# EAGLE design pi-crust-protohat (EAGLE 7.6.0)
PiCrust B+ HAT
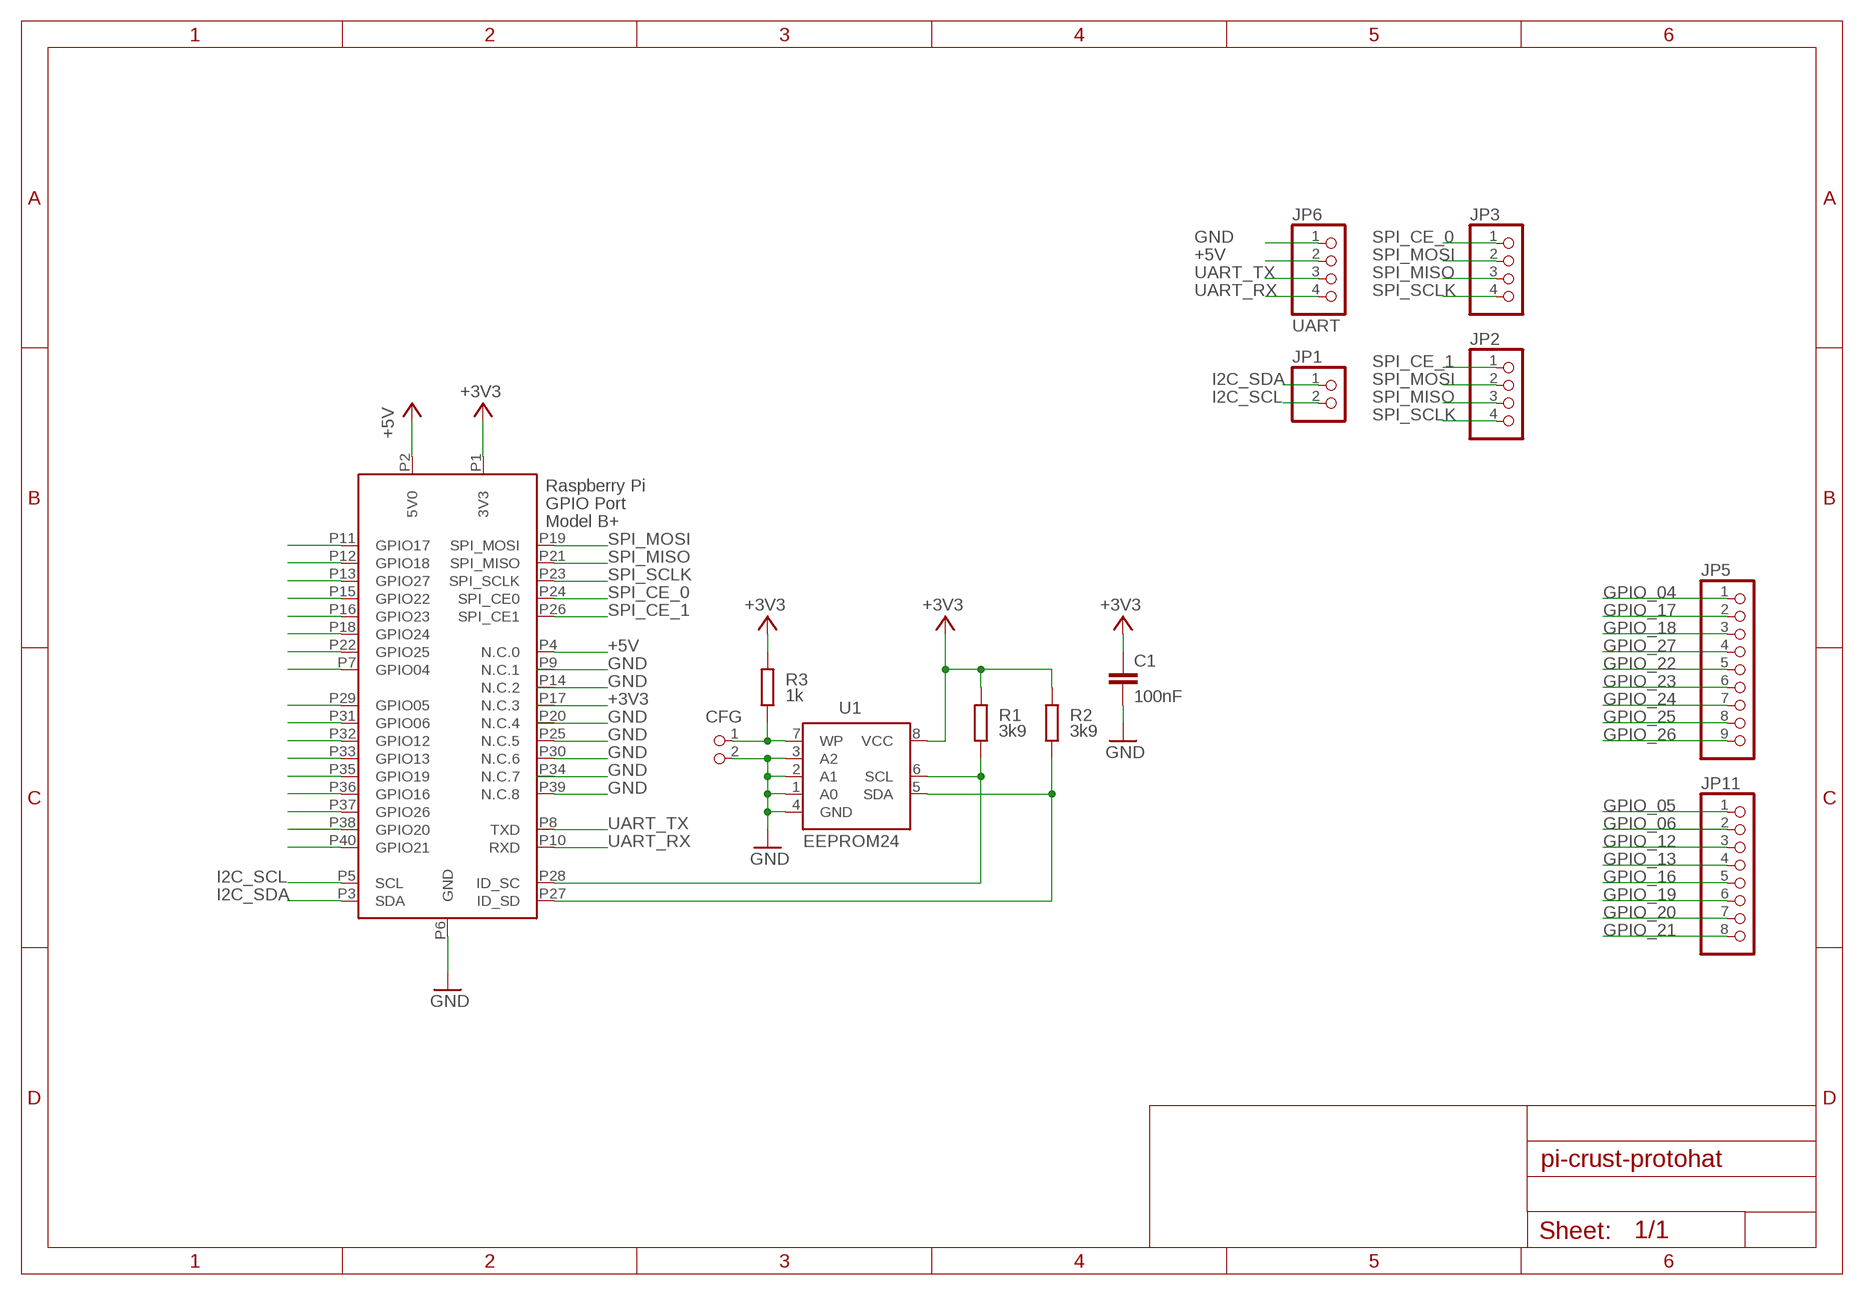
[diagram p0: schematic, sheet 1]

## Parts
C1  100nF  C-EUC0805K  [C0805K]
CFG  PIN2_100  [PIN_W_2]
JP1  PINHD-1X2  [1X02]
JP2  PINHD-1X4  [1X04]
JP3  PINHD-1X4  [1X04]
JP5  PINHD-1X9  [1X09]
JP6  UART  PINHD-1X4  [1X04]
JP11  PINHD-1X8  [1X08]
R1  3k9  R-EU_M0805  [M0805]
R2  3k9  R-EU_M0805  [M0805]
R3  1k  R-EU_M0805  [M0805]
U1  EEPROM24  [SOIC8]
U$1  RASPI_BOARD_B+_SMD  [RASPI_BOARD_B+_SMD_CONNECTOR]

## Nets
+3V3: C1.1 R1.2 R2.2 R3.2 U1.8(VCC) U$1.P1(3V3)
+5V: JP6.2 U$1.P2(5V0) U$1.P4(N.C.0)
GND: C1.2 CFG.2 JP6.1 U1.1(A0) U1.2(A1) U1.3(A2) U1.4(GND) U$1.P6(GND) U$1.P25(N.C.5) U$1.P30(N.C.6) U$1.P39(N.C.8)
GPIO_04: JP5.1 U$1.P7(GPIO04)
GPIO_05: JP11.1 U$1.P29(GPIO05)
GPIO_06: JP11.2 U$1.P31(GPIO06)
GPIO_12: JP11.3 U$1.P32(GPIO12)
GPIO_13: JP11.4 U$1.P33(GPIO13)
GPIO_16: JP11.5 U$1.P36(GPIO16)
GPIO_17: JP5.2 U$1.P11(GPIO17)
GPIO_18: JP5.3 U$1.P12(GPIO18)
GPIO_19: JP11.6 U$1.P35(GPIO19)
GPIO_20: JP11.7 U$1.P38(GPIO20)
GPIO_21: JP11.8 U$1.P40(GPIO21)
GPIO_22: JP5.5 U$1.P15(GPIO22)
GPIO_23: JP5.6 U$1.P16(GPIO23)
GPIO_24: JP5.7 U$1.P18(GPIO24)
GPIO_25: JP5.8 U$1.P22(GPIO25)
GPIO_26: JP5.9 U$1.P37(GPIO26)
GPIO_27: JP5.4 U$1.P13(GPIO27)
I2C_SCL: JP1.2 U$1.P5(SCL)
I2C_SDA: JP1.1 U$1.P3(SDA)
N$3: CFG.1 R3.1 U1.7(WP)
N$4: R1.1 U1.6(SCL) U$1.P28(ID_SC)
N$5: R2.1 U1.5(SDA) U$1.P27(ID_SD)
SPI_CE_0: JP3.1 U$1.P24(SPI_CE0)
SPI_CE_1: JP2.1 U$1.P26(SPI_CE1)
SPI_MISO: JP2.3 JP3.3 U$1.P21(SPI_MISO)
SPI_MOSI: JP2.2 JP3.2 U$1.P19(SPI_MOSI)
SPI_SCLK: JP2.4 JP3.4 U$1.P23(SPI_SCLK)
UART_RX: JP6.4 U$1.P10(RXD)
UART_TX: JP6.3 U$1.P8(TXD)
Unconnected: U$1.P9(N.C.1) U$1.P14(N.C.2) U$1.P17(N.C.3) U$1.P20(N.C.4) U$1.P34(N.C.7)

## Library data of the parts
C1 = resistor:C-EU: CAPACITOR, European symbol; DIELECTRIC: X7R
CFG = FLYFISH:PIN2
JP1 = pinhead:PINHD-1X2: PIN HEADER
JP2 JP3 JP6 = pinhead:PINHD-1X4: PIN HEADER
JP5 = pinhead:PINHD-1X9: PIN HEADER
JP11 = pinhead:PINHD-1X8: PIN HEADER
R1-R3 = resistor:R-EU_: RESISTOR, European symbol; TOLERANCE: 5%
U1 = FLYFISH:EEPROM24
U$1 = raspberrypi_bastelstube_v13:RASPI_BOARD_B+_SMD

## Board
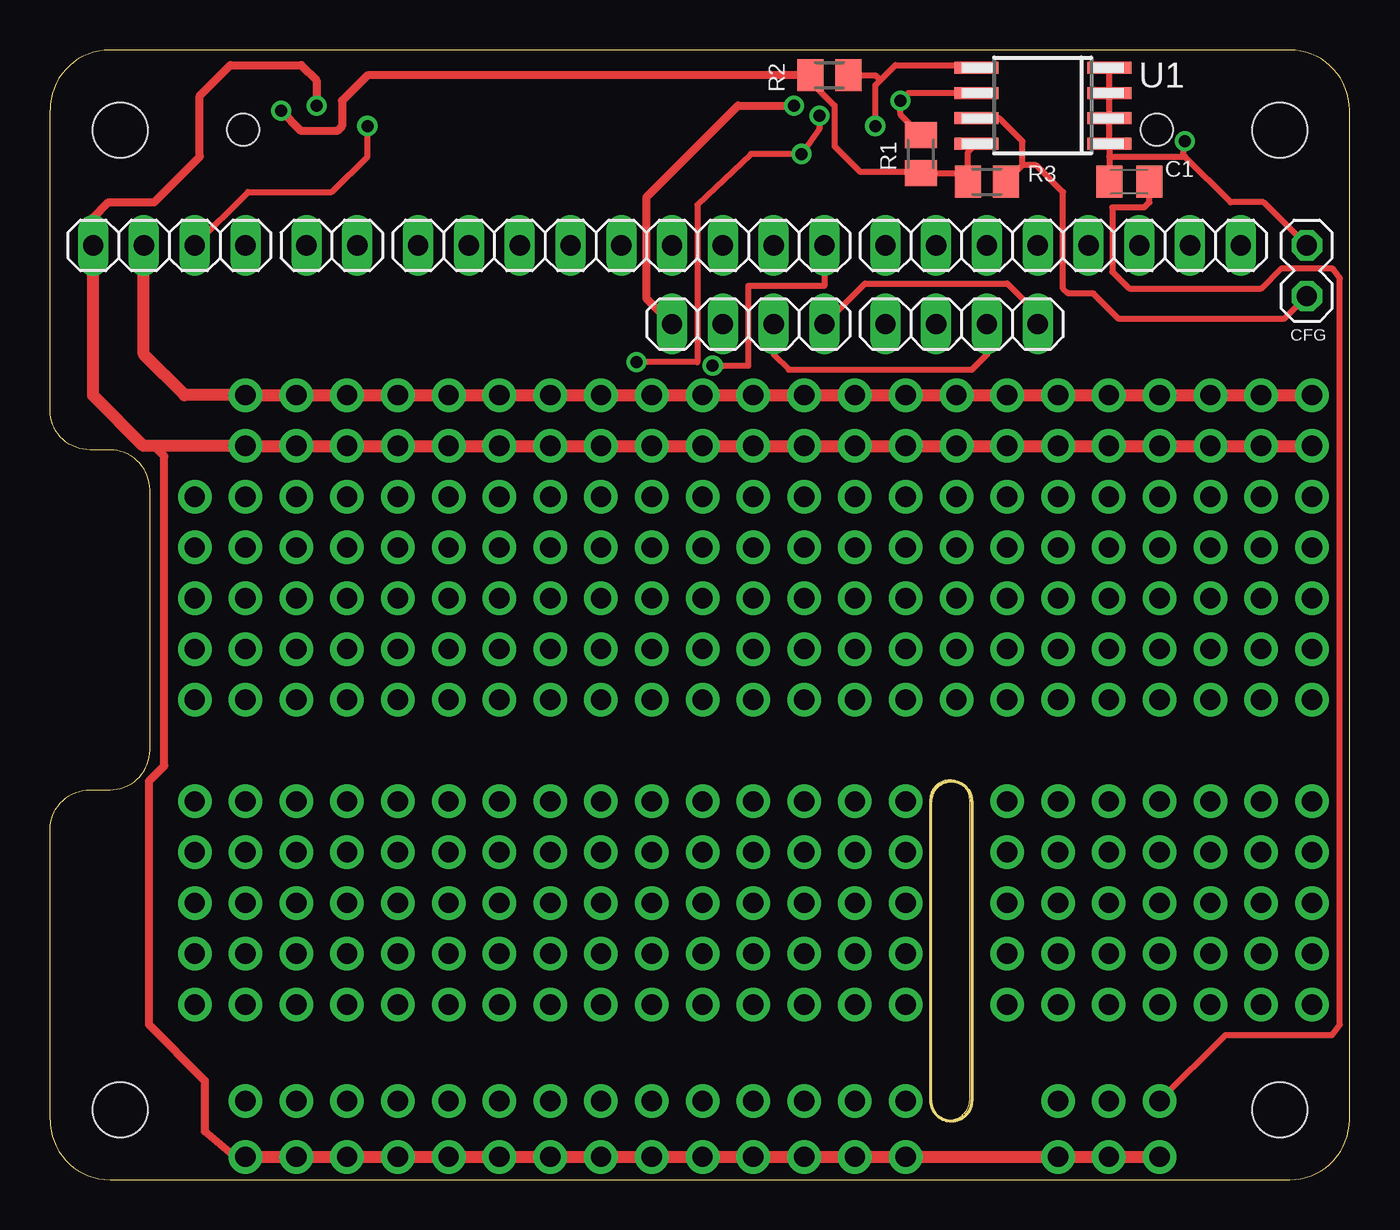
[diagram p1: board, top side]
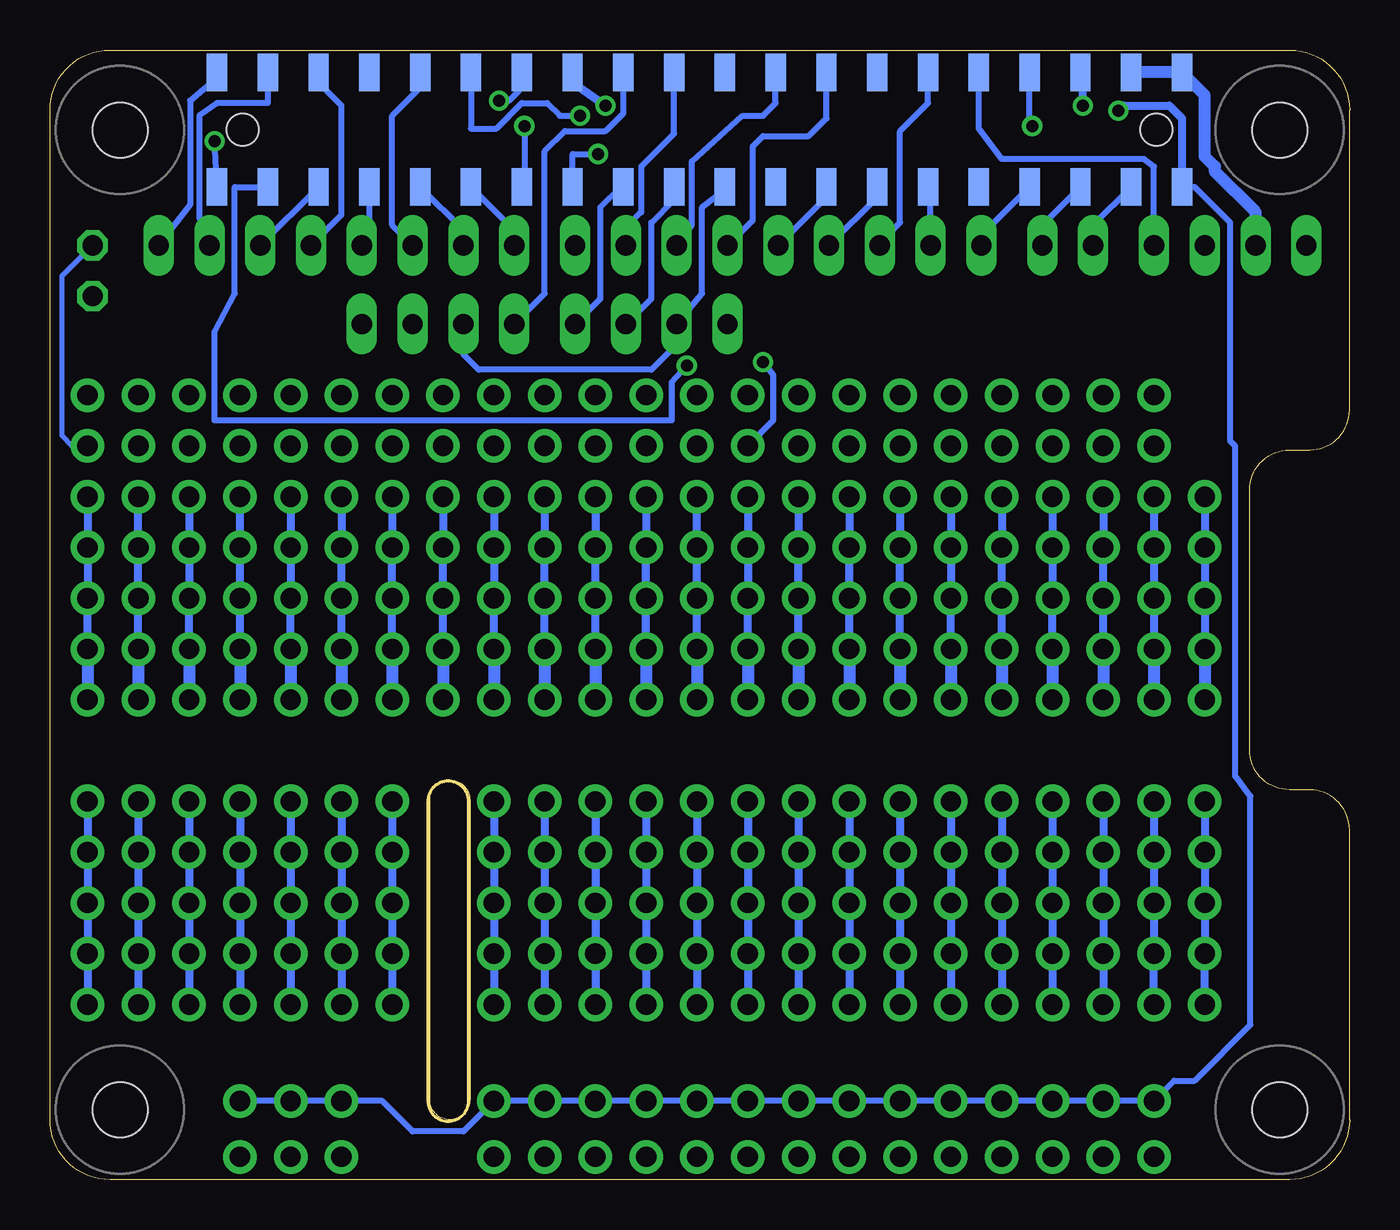
[diagram p2: board, bottom side, seen from below]

Size 65 x 56.51 mm. Coordinates in mm from the lower left corner, seen from the top.
Outline: 44.07,3.94 44.07,18.92 arc-180 46.1,18.92 46.1,3.94 arc-180 44.07,3.94
Copper layers (1*16): Top 0.035mm / dielectric 1.5mm / Bottom 0.035mm
Design rules "default *": minimum track width 10mil, minimum drill 24mil, track to track 8mil, track to pad 8mil, pad to pad 8mil, via to via 8mil, smd to smd 8mil, copper to edge 40mil, drill to drill 8mil, minimum pad ring 10mil, minimum via ring 8mil, stop-mask expansion 4mil, vias tented up to drill 24mil, thermal gap 10mil

### Footprints (pad centres in the part's own frame; a part is rotated, then mirrored left to right if it is on the bottom)
C0805K = smd 1.3 x 1.6: 1 -1,0; 2 1,0
PIN_W_2 = drill 1.016 octagon: 1 0,0; 2 0,-2.54
1X02 = drill 1.016 long: 1 -1.27,0; 2 1.27,0
1X04 = drill 1.016 long: 1 -3.81,0; 2 -1.27,0; 3 1.27,0; 4 3.81,0
1X09 = drill 1.016 long: 1 -10.16,0; 2 -7.62,0; 3 -5.08,0; 4 -2.54,0; 5 0,0; 6 2.54,0; 7 5.08,0; 8 7.62,0; 9 10.16,0
1X08 = drill 1.016 long: 1 -8.89,0; 2 -6.35,0; 3 -3.81,0; 4 -1.27,0; 5 1.27,0; 6 3.81,0; 7 6.35,0; 8 8.89,0
M0805 = smd 1.3 x 1.6: 1 -0.95,0; 2 0.95,0
SOIC8 = smd 0.6 x 2.2: 1 -1.905,-3.33; 2 -0.635,-3.33; 3 0.635,-3.33; 4 1.905,-3.33; 5 1.905,3.33; 6 0.635,3.33; 7 -0.635,3.33; 8 -1.905,3.33
RASPI_BOARD_B+_SMD_CONNECTOR = smd 1.02 x 1.87 bottom: P1 4.953,-2.794; P2 4.953,2.936; P3 7.493,-2.794; P4 7.493,2.936; P5 10.033,-2.794; P6 10.033,2.936; P7 12.573,-2.794; P8 12.573,2.936; P9 15.113,-2.794; P10 15.113,2.936; P11 17.653,-2.794; P12 17.653,2.936; P13 20.193,-2.794; P14 20.193,2.936; P15 22.733,-2.794; P16 22.733,2.936; P17 25.273,-2.794; P18 25.273,2.936; P19 27.813,-2.794; P20 27.813,2.936; P21 30.353,-2.794; P22 30.353,2.936; P23 32.893,-2.794; P24 32.893,2.936; P25 35.433,-2.794; P26 35.433,2.936; P27 37.973,-2.794; P28 37.973,2.936; P29 40.513,-2.794; P30 40.513,2.936; P31 43.053,-2.794; P32 43.053,2.936; P33 45.593,-2.794; P34 45.593,2.936; P35 48.133,-2.794; P36 48.133,2.936; P37 50.673,-2.794; P38 50.673,2.936; P39 53.213,-2.794; P40 53.213,2.936 | hole 2.75: 0.071,-48.951; 0.071,0.049; 58.071,-48.951; 58.071,0.049 | hole 1.6: 6.223,0.071; 51.943,0.071

### Placement (x,y rotation side)
C1  53.98,49.91 180 top
CFG  62.87,44.2 180 top
JP1  14.1,46.74 0 top
JP2  34.93,42.8 0 top
JP3  45.59,42.8 0 top
JP5  28.57,46.74 0 top
JP6  5.97,46.74 0 top
JP11  50.67,46.74 0 top
R1  43.56,51.31 270 top
R2  38.99,55.25 180 top
R3  46.86,49.91 180 top
U1  49.66,53.72 90 top
U$1  3.43,52.45 0 top

### Tracks (layer width: path | path; a pad name or v marks a point on that pad's centre or on a via)
+3V3  (via drill 0.6, 1.02 pad 1.68)
  Top 0.305: v55.5,3.94 58.8,7.24 64.13,7.24 64.52,7.75 64.52,45.09 64.13,45.59 61.6,45.59 60.58,44.58 53.98,44.58 53.14,45.42 53.14,48.64 54.74,48.64 54.99,48.9 54.99,49.9 C1.1 | R2.2 38.04,54.93 39.24,53.72 39.24,51.69 40.51,50.42 43.5,50.42 R1.2 45.47,50.36 R3.2 45.91,51.4 U1.8
  Top 0.406: R2.2 15.88,55.25 14.61,53.98 14.61,52.71 14.35,52.45 12.57,52.45 v11.56,53.47
  Bottom 0.254: 55.5,4.06 v55.5,3.94
  Bottom 0.305: v55.5,3.94 v52.96,3.94 v50.42,3.94 48.39,3.94 46.86,2.41 44.32,2.41 v42.8,3.94 v40.26,3.94 v37.72,3.94 v35.18,3.94 v32.64,3.94 v30.1,3.94 v27.56,3.94 v25.02,3.94 v22.48,3.94 v19.94,3.94 v17.4,3.94 v14.86,3.94 v12.32,3.94 v9.78,3.94 8.76,4.95 7.75,4.95 4.95,7.75 4.95,19.18 5.71,20.19 5.71,36.7 5.97,36.96 5.97,47.88 7.75,49.66 U$1.P1
  Bottom 0.406: v11.56,53.47 11.3,53.72 9.02,53.72 8.38,53.09 U$1.P1
+5V  (via drill 1.02 pad 1.68)
  Top 0.61: v63.12,39.24 v60.58,39.24 v58.04,39.24 v55.5,39.24 v52.96,39.24 v50.42,39.24 v47.88,39.24 v45.34,39.24 v42.8,39.24 v40.26,39.24 v37.72,39.24 v35.18,39.24 v32.64,39.24 v30.1,39.24 v27.56,39.24 v25.02,39.24 v22.48,39.24 v19.94,39.24 v17.4,39.24 v14.86,39.24 v12.32,39.24 v9.78,39.24 6.73,39.24 4.7,41.28 JP6.2
  Bottom 0.61: JP6.2 4.7,48.39 6.73,50.42 6.73,50.67 7.24,51.18 7.24,54.24 U$1.P2 U$1.P4
GND  (via drill 0.6, 0.76 pad 1.68, 1.02 pad 1.68)
  Top 0.305: U1.1 U1.2 U1.3 U1.4 | U1.1 C1.2 | CFG.2 60.71,48.9 59.05,48.9 56.77,51.18 56.64,51.18 | U1.1 52.99,51.18 56.64,51.18 | v56.77,51.94 56.64,51.18 | v29.34,40.89 32.39,40.89 32.39,48.77 35.05,51.31 v37.59,51.31 38.48,52.58 v38.48,53.21
  Top 0.406: 9.27,1.14 7.75,2.41 7.75,4.95 4.95,7.75 4.95,19.94 5.71,20.7 5.71,36.2 5.21,36.7 | JP6.1 2.16,48.13 2.92,48.9 5.21,48.9 7.49,51.18 7.49,54.23 9.02,55.75 12.57,55.75 13.34,54.99 v13.34,53.72
  Top 0.61: 9.27,1.14 v9.78,1.14 v12.32,1.14 v14.86,1.14 v17.4,1.14 v19.94,1.14 v22.48,1.14 v25.02,1.14 v27.56,1.14 v30.1,1.14 v32.64,1.14 v35.18,1.14 v37.72,1.14 | v55.5,1.14 v52.96,1.14 v50.42,1.14 v37.72,1.14 | v63.12,36.7 v60.58,36.7 v58.04,36.7 v55.5,36.7 v52.96,36.7 v50.42,36.7 v47.88,36.7 v45.34,36.7 v42.8,36.7 v40.26,36.7 v37.72,36.7 v35.18,36.7 v32.64,36.7 v30.1,36.7 v27.56,36.7 v25.02,36.7 v22.48,36.7 v19.94,36.7 v17.4,36.7 v14.86,36.7 v12.32,36.7 v9.78,36.7 5.21,36.7 4.7,36.7 2.16,39.24 JP6.1 | v37.72,1.14 v40.26,1.14 v42.8,1.14
  Bottom 0.254: v63.12,36.7 63.88,36.7 64.39,37.21 64.39,45.21 CFG.2
  Bottom 0.305: U$1.P39 v56.77,51.94 | U$1.P25 38.86,51.31 v37.59,51.31 | v29.34,40.89 28.83,40.26 28.83,37.97 v30.1,36.7 | U$1.P30 43.94,52.58 42.67,52.58 41.4,53.85 40.13,53.85 39.5,53.21 v38.48,53.21
  Bottom 0.406: v13.34,53.72 13.34,55.26 U$1.P6
GPIO_04
  Bottom 0.305: JP5.1 18.41,47.24 U$1.P7
GPIO_05
  Bottom 0.305: JP11.1 41.78,47.5 U$1.P29
GPIO_06
  Bottom 0.305: JP11.2 44.32,47.5 U$1.P31
GPIO_12
  Bottom 0.305: JP11.3 47.88,47.75 47.88,53.21 46.48,54.61 U$1.P32
GPIO_13
  Bottom 0.305: JP11.4 49.02,47.12 U$1.P33
GPIO_16
  Bottom 0.305: JP11.5 50.42,48.26 50.42,53.72 51.56,54.86 U$1.P36
GPIO_17
  Bottom 0.305: JP5.2 20.95,49.53 U$1.P11
GPIO_18
  Bottom 0.305: JP5.3 23.49,46.86 22.48,47.88 22.48,52.45 21.08,53.85 U$1.P12
GPIO_19
  Bottom 0.305: JP11.6 U$1.P35
GPIO_20
  Bottom 0.305: U$1.P38 54.1,53.85 56.64,53.85 57.53,53.21 57.53,48.13 JP11.7
GPIO_21
  Bottom 0.305: U$1.P40 56.64,55.12 57.99,53.98 57.99,48.77 JP11.8
GPIO_22
  Bottom 0.305: JP5.5 26.16,49.15 U$1.P15
GPIO_23
  Bottom 0.305: JP5.6 29.84,48.01 29.84,51.69 29.34,52.2 27.05,52.2 26.16,53.09 U$1.P16
GPIO_24
  Bottom 0.305: JP5.7 32.89,47.75 32.89,50.93 30.35,53.21 29.34,53.21 28.7,53.85 U$1.P18
GPIO_25
  Bottom 0.305: U$1.P22 33.78,52.32 35.43,50.67 35.43,48.39 36.2,47.62 JP5.8
GPIO_26  (via drill 0.6)
  Top 0.305: JP5.9 38.73,44.7 34.93,44.7 34.93,40.72 v33.15,40.72
  Bottom 0.305: v33.15,40.72 33.91,39.88 33.91,37.97 56.77,37.97 56.77,42.42 55.75,44.32 55.75,49.66 U$1.P37
GPIO_27
  Bottom 0.305: JP5.4 23.62,49.15 U$1.P13
I2C_SCL
  Bottom 0.305: JP1.2 15.37,47.75 U$1.P5
I2C_SDA
  Bottom 0.305: JP1.1 12.83,47.75 U$1.P3
N$1  (via drill 1.02 pad 1.68)
  Bottom 0.406: v7.24,34.16 v7.24,31.62 v7.24,29.08 v7.24,26.54
  Bottom 0.61: v7.24,26.54 v7.24,24
N$2  (via drill 1.02 pad 1.68)
  Bottom 0.406: v7.24,18.92 v7.24,16.38 v7.24,13.84 v7.24,11.3 v7.24,8.76
N$3
  Top 0.305: R3.1 48.64,50.74 | 48.64,50.74 48.64,51.94 47.5,53.09 U1.7 | CFG.1 61.72,43.05 53.47,43.05 52.2,44.32 50.93,44.32 50.67,44.58 50.67,49.4 49.34,50.74 48.64,50.74
N$4  (via drill 0.6)
  Top 0.305: U1.6 42.93,54.36 v42.55,53.98 42.55,53.27 R1.1
  Bottom 0.305: v42.55,53.98 42.04,53.98 41.53,54.48 41.53,55.77 U$1.P28
N$5  (via drill 0.6)
  Top 0.305: v41.28,52.71 41.28,54.74 41.53,54.99 | 41.53,54.99 42.29,55.75 46.2,55.75 U1.5 | R2.1 41.28,55.25 41.53,54.99
  Bottom 0.305: v41.28,52.71 41.28,50.29 U$1.P27
N$6  (via drill 1.02 pad 1.68)
  Bottom 0.406: v45.34,34.16 v45.34,31.62 v45.34,29.08 v45.34,26.54
  Bottom 0.61: v45.34,26.54 v45.34,24
N$7  (via drill 1.02 pad 1.68)
  Bottom 0.406: v47.88,34.16 v47.88,31.62 v47.88,29.08 v47.88,26.54
  Bottom 0.61: v47.88,26.54 v47.88,24
N$8  (via drill 1.02 pad 1.68)
  Bottom 0.406: v60.58,34.16 v60.58,31.62 v60.58,29.08 v60.58,26.54
  Bottom 0.61: v60.58,26.54 v60.58,24
N$9  (via drill 1.02 pad 1.68)
  Bottom 0.406: v63.12,34.16 v63.12,31.62 v63.12,29.08 v63.12,26.54
  Bottom 0.61: v63.12,26.54 v63.12,24
N$10  (via drill 1.02 pad 1.68)
  Bottom 0.406: v58.04,18.92 v58.04,16.38 v58.04,13.84 v58.04,11.3 v58.04,8.76
N$11  (via drill 1.02 pad 1.68)
  Bottom 0.406: v60.58,18.92 v60.58,16.38 v60.58,13.84 v60.58,11.3 v60.58,8.76
N$12  (via drill 1.02 pad 1.68)
  Bottom 0.406: v63.12,18.92 v63.12,16.38 v63.12,13.84 v63.12,11.3 v63.12,8.76
N$51  (via drill 1.02 pad 1.68)
  Bottom 0.406: v9.78,34.16 v9.78,31.62 v9.78,29.08 v9.78,26.54
  Bottom 0.61: v9.78,26.54 v9.78,24
N$144  (via drill 1.02 pad 1.68)
  Bottom 0.406: v12.32,34.16 v12.32,31.62 v12.32,29.08 v12.32,26.54
  Bottom 0.61: v12.32,26.54 v12.32,24
N$145  (via drill 1.02 pad 1.68)
  Bottom 0.406: v14.86,34.16 v14.86,31.62 v14.86,29.08 v14.86,26.54
  Bottom 0.61: v14.86,26.54 v14.86,24
N$146  (via drill 1.02 pad 1.68)
  Bottom 0.406: v17.4,34.16 v17.4,31.62 v17.4,29.08 v17.4,26.54
  Bottom 0.61: v17.4,26.54 v17.4,24
N$147  (via drill 1.02 pad 1.68)
  Bottom 0.406: v19.94,34.16 v19.94,31.62 v19.94,29.08 v19.94,26.54
  Bottom 0.61: v19.94,26.54 v19.94,24
N$148  (via drill 1.02 pad 1.68)
  Bottom 0.406: v22.48,34.16 v22.48,31.62 v22.48,29.08 v22.48,26.54
  Bottom 0.61: v22.48,26.54 v22.48,24
N$149  (via drill 1.02 pad 1.68)
  Bottom 0.406: v25.02,34.16 v25.02,31.62 v25.02,29.08 v25.02,26.54
  Bottom 0.61: v25.02,26.54 v25.02,24
N$150  (via drill 1.02 pad 1.68)
  Bottom 0.406: v27.56,34.16 v27.56,31.62 v27.56,29.08 v27.56,26.54
  Bottom 0.61: v27.56,26.54 v27.56,24
N$151  (via drill 1.02 pad 1.68)
  Bottom 0.406: v30.1,34.16 v30.1,31.62 v30.1,29.08 v30.1,26.54
  Bottom 0.61: v30.1,26.54 v30.1,24
N$152  (via drill 1.02 pad 1.68)
  Bottom 0.406: v32.64,34.16 v32.64,31.62 v32.64,29.08 v32.64,26.54
  Bottom 0.61: v32.64,26.54 v32.64,24
N$153  (via drill 1.02 pad 1.68)
  Bottom 0.406: v35.18,34.16 v35.18,31.62 v35.18,29.08 v35.18,26.54
  Bottom 0.61: v35.18,26.54 v35.18,24
N$154  (via drill 0.76 pad 1.68, 1.02 pad 1.68)
  Bottom 0.406: v37.72,34.16 v37.72,31.62 v37.72,29.08 v37.72,26.54
  Bottom 0.61: v37.72,26.54 v37.72,24
N$155  (via drill 1.02 pad 1.68)
  Bottom 0.406: v40.26,34.16 v40.26,31.62 v40.26,29.08 v40.26,26.54
  Bottom 0.61: v40.26,26.54 v40.26,24
N$156  (via drill 1.02 pad 1.68)
  Bottom 0.406: v42.8,34.16 v42.8,31.62 v42.8,29.08 v42.8,26.54
  Bottom 0.61: v42.8,26.54 v42.8,24
N$158  (via drill 1.02 pad 1.68)
  Bottom 0.406: v9.78,18.92 v9.78,16.38 v9.78,13.84 v9.78,11.3 v9.78,8.76
N$159  (via drill 1.02 pad 1.68)
  Bottom 0.406: v12.32,18.92 v12.32,16.38 v12.32,13.84 v12.32,11.3 v12.32,8.76
N$160  (via drill 1.02 pad 1.68)
  Bottom 0.406: v14.86,18.92 v14.86,16.38 v14.86,13.84 v14.86,11.3 v14.86,8.76
N$161  (via drill 1.02 pad 1.68)
  Bottom 0.406: v17.4,18.92 v17.4,16.38 v17.4,13.84 v17.4,11.3 v17.4,8.76
N$162  (via drill 1.02 pad 1.68)
  Bottom 0.406: v19.94,18.92 v19.94,16.38 v19.94,13.84 v19.94,11.3 v19.94,8.76
N$163  (via drill 1.02 pad 1.68)
  Bottom 0.406: v22.48,18.92 v22.48,16.38 v22.48,13.84 v22.48,11.3 v22.48,8.76
N$164  (via drill 1.02 pad 1.68)
  Bottom 0.406: v25.02,18.92 v25.02,16.38 v25.02,13.84 v25.02,11.3 v25.02,8.76
N$165  (via drill 1.02 pad 1.68)
  Bottom 0.406: v27.56,18.92 v27.56,16.38 v27.56,13.84 v27.56,11.3 v27.56,8.76
N$166  (via drill 1.02 pad 1.68)
  Bottom 0.406: v30.1,18.92 v30.1,16.38 v30.1,13.84 v30.1,11.3 v30.1,8.76
N$167  (via drill 1.02 pad 1.68)
  Bottom 0.406: v32.64,18.92 v32.64,16.38 v32.64,13.84 v32.64,11.3 v32.64,8.76
N$168  (via drill 1.02 pad 1.68)
  Bottom 0.406: v35.18,18.92 v35.18,16.38 v35.18,13.84 v35.18,11.3 v35.18,8.76
N$169  (via drill 1.02 pad 1.68)
  Bottom 0.406: v37.72,18.92 v37.72,16.38 v37.72,13.84 v37.72,11.3 v37.72,8.76
N$170  (via drill 1.02 pad 1.68)
  Bottom 0.406: v40.26,18.92 v40.26,16.38 v40.26,13.84 v40.26,11.3 v40.26,8.76
N$171  (via drill 1.02 pad 1.68)
  Bottom 0.406: v42.8,18.92 v42.8,16.38 v42.8,13.84 v42.8,11.3 v42.8,8.76
N$232  (via drill 1.02 pad 1.68)
  Bottom 0.406: v50.42,34.16 v50.42,31.62 v50.42,29.08 v50.42,26.54
  Bottom 0.61: v50.42,26.54 v50.42,24
N$233  (via drill 1.02 pad 1.68)
  Bottom 0.406: v52.96,34.16 v52.96,31.62 v52.96,29.08 v52.96,26.54
  Bottom 0.61: v52.96,26.54 v52.96,24
N$234  (via drill 1.02 pad 1.68)
  Bottom 0.406: v55.5,34.16 v55.5,31.62 v55.5,29.08 v55.5,26.54
  Bottom 0.61: v55.5,26.54 v55.5,24
N$235  (via drill 1.02 pad 1.68)
  Bottom 0.406: v58.04,34.16 v58.04,31.62 v58.04,29.08 v58.04,26.54
  Bottom 0.61: v58.04,26.54 v58.04,24
N$238  (via drill 1.02 pad 1.68)
  Bottom 0.406: v47.88,18.92 v47.88,16.38 v47.88,13.84 v47.88,11.3 v47.88,8.76
N$239  (via drill 1.02 pad 1.68)
  Bottom 0.406: v50.42,18.92 v50.42,16.38 v50.42,13.84 v50.42,11.3 v50.42,8.76
N$240  (via drill 1.02 pad 1.68)
  Bottom 0.406: v52.96,18.92 v52.96,16.38 v52.96,13.84 v52.96,11.3 v52.96,8.76
N$241  (via drill 1.02 pad 1.68)
  Bottom 0.406: v55.5,18.92 v55.5,16.38 v55.5,13.84 v55.5,11.3 v55.5,8.76
SPI_CE_0
  Bottom 0.305: JP3.1 40.26,44.32 40.26,51.44 39.24,52.45 37.21,52.45 36.32,53.34 U$1.P24
SPI_CE_1  (via drill 0.6)
  Top 0.406: JP2.1 29.84,44.07 29.84,49.15 34.42,53.72 v37.21,53.72
  Bottom 0.406: v37.21,53.72 38.86,54.86 U$1.P26
SPI_MISO
  Top 0.305: JP2.3 36.2,41.28 36.96,40.51 46.1,40.51 46.86,41.28 JP3.3
  Bottom 0.305: JP2.3 34.93,44.07 34.93,47.88 33.78,49.02 U$1.P21
SPI_MOSI
  Bottom 0.305: U$1.P19 31.24,49.53 32.39,48.64 32.39,44.32 JP2.2 33.66,41.78 34.93,40.51 43.56,40.51 44.32,41.28 JP3.2
SPI_SCLK
  Top 0.305: JP2.4 40.77,44.83 47.88,44.83 49.4,43.31 JP3.4
  Bottom 0.305: JP2.4 37.47,44.07 37.47,48.64 36.45,49.66 U$1.P23
UART_RX
  Bottom 0.305: JP6.4 9.78,50.67 10.29,51.05 17.4,51.05 18.54,52.58 U$1.P10
UART_TX  (via drill 0.6)
  Top 0.305: JP6.3 9.91,49.4 14.1,49.4 15.88,51.18 v15.88,52.71
  Bottom 0.305: v15.88,52.71 16,52.83 U$1.P8

### Text on the board
tValues: 4 | 17 | 18 | 27 | 22 | 23 | 24 | 25 | 26 | 5 | 6 | 12 | 13 | 16 | 19 | 20 | 21 | SDA | SCL | GND | +5V | TX | RX | CE1 | MOSI | MISO | CLK | CE0 | MOSI | MISO | CLK | UART | I2C | +5V | GND | picru.st pi-supply.com | +3V3 | +3V3 | GND | GND
tDocu: Pi Crust ProtoHAT v1.0